# EAGLE design cdf-modular-bridge-rev4 (EAGLE 7.3.0)
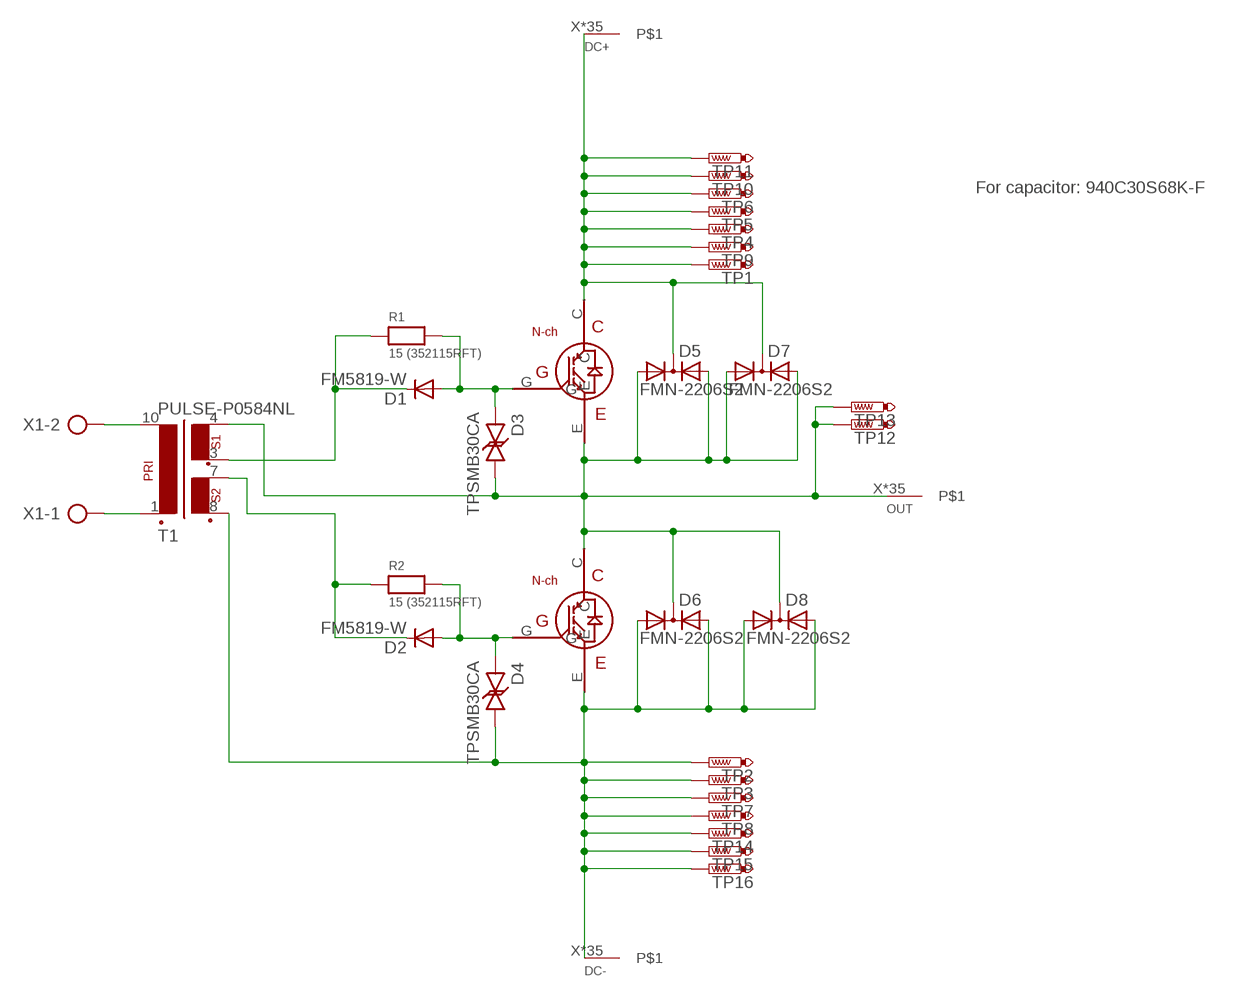
[diagram p0: schematic, sheet 1]

## Parts
D1  FM5819-W  S1A  [DO214AC]
D2  FM5819-W  S1A  [DO214AC]
D3  TPSMB30CA  TPSMB15CA  [TPSMB15CA]
D4  TPSMB30CA  TPSMB15CA  [TPSMB15CA]
D5  FMN-2206S2  [TO220-CDF-SPACED-LEGS]
D6  FMN-2206S2  [TO220-CDF-SPACED-LEGS]
D7  FMN-2206S2  [TO220-CDF-SPACED-LEGS]
D8  FMN-2206S2  [TO220-CDF-SPACED-LEGS]
DC+  BIG-ASS-HOLE  [BIG-ASS-HOLE]
DC-  BIG-ASS-HOLE  [BIG-ASS-HOLE]
OUT  BIG-ASS-HOLE  [BIG-ASS-HOLE]
Q1  Ixgh48n60a3  IXGH40N60A  [IXGH40N60A]
Q2  Ixgh48n60a3  IXGH40N60A  [IXGH40N60A]
R1  15 (352115RFT)  RESISTOR2512  [2512]
R2  15 (352115RFT)  RESISTOR2512  [2512]
T1  PULSE-P0584NL  [PULSE-P0584NL]
TP1  PTR1PAD1-17  [P1-17]
TP2  PTR1PAD1-17  [P1-17]
TP3  PTR1PAD1-17  [P1-17]
TP4  PTR1PAD1-17  [P1-17]
TP5  PTR1PAD1-17  [P1-17]
TP6  PTR1PAD1-17  [P1-17]
TP7  PTR1PAD1-17  [P1-17]
TP8  PTR1PAD1-17  [P1-17]
TP9  PTR1PAD1-17  [P1-17]
TP10  PTR1PAD1-17  [P1-17]
TP11  PTR1PAD1-17  [P1-17]
TP12  PTR1PAD1-17  [P1-17]
TP13  PTR1PAD1-17  [P1-17]
TP14  PTR1PAD1-17  [P1-17]
TP15  PTR1PAD1-17  [P1-17]
TP16  PTR1PAD1-17  [P1-17]
X1  AK500/2  [AK500/2]

## Nets
DC+: D5.C D7.C DC+.X DC+.X@1 DC+.X@2 DC+.X@3 DC+.X@4 DC+.X@5 DC+.X@6 DC+.X@7 DC+.X@8 DC+.X@9 DC+.X@10 DC+.X@11 DC+.X@12 DC+.X@13 DC+.X@14 DC+.X@15 DC+.X@16 DC+.X@17 DC+.X@18 DC+.X@19 DC+.X@20 DC+.X@21 DC+.X@22 DC+.X@23 DC+.X@24 DC+.X@25 DC+.X@26 DC+.X@27 DC+.X@28 DC+.X@29 DC+.X@30 DC+.X@31 DC+.X@32 DC+.X@34 DC+.X@120 Q1.C TP1.TP TP4.TP TP5.TP TP6.TP TP9.TP TP10.TP TP11.TP
DC-: D4.P$2 D6.A1 D6.A2 D8.A1 D8.A2 DC-.X DC-.X@1 DC-.X@2 DC-.X@3 DC-.X@4 DC-.X@5 DC-.X@6 DC-.X@7 DC-.X@8 DC-.X@9 DC-.X@10 DC-.X@11 DC-.X@12 DC-.X@13 DC-.X@14 DC-.X@15 DC-.X@16 DC-.X@17 DC-.X@18 DC-.X@19 DC-.X@20 DC-.X@21 DC-.X@22 DC-.X@23 DC-.X@24 DC-.X@25 DC-.X@26 DC-.X@27 DC-.X@28 DC-.X@29 DC-.X@30 DC-.X@31 DC-.X@32 DC-.X@34 DC-.X@120 Q2.E T1.8(SEC2_POS) TP2.TP TP3.TP TP7.TP TP8.TP TP14.TP TP15.TP TP16.TP
N$1: T1.10(PRI_NEG) X1.2
N$2: T1.1(PRI_POS) X1.1
N$3: D1.A D3.P$1 Q1.G R1.2
N$5: D2.A D4.P$1 Q2.G R2.2
N$7: D2.C R2.1 T1.7(SEC2_NEG)
N$8: D1.C R1.1 T1.3(SEC1_POS)
OUT: D3.P$2 D5.A1 D5.A2 D6.C D7.A1 D7.A2 D8.C OUT.X OUT.X@1 OUT.X@2 OUT.X@3 OUT.X@4 OUT.X@5 OUT.X@6 OUT.X@7 OUT.X@8 OUT.X@9 OUT.X@10 OUT.X@11 OUT.X@12 OUT.X@13 OUT.X@14 OUT.X@15 OUT.X@16 OUT.X@17 OUT.X@18 OUT.X@19 OUT.X@20 OUT.X@21 OUT.X@22 OUT.X@23 OUT.X@24 OUT.X@25 OUT.X@26 OUT.X@27 OUT.X@28 OUT.X@29 OUT.X@30 OUT.X@31 OUT.X@32 OUT.X@34 OUT.X@120 Q1.E Q2.C T1.4(SEC1_NEG) TP12.TP TP13.TP

## Notes on the sheet
- For capacitor: 940C30S68K-F

## Library data of the parts
D1 D2 = s1x_10:S1*: S1A - S1M General Purpose Rectifiers Source: http://www.fairchildsemi.com/datasheets/S1/S1A.pdf; MF: Fairchild; MPN: S1A; OC_FARNELL: 9843868; OC_NEWARK: 58K9551
D3 D4 = keves:TPSMB15CA
D5-D8 = keves:FMN-2206S
DC+ DC- OUT = keves:BIG-ASS-HOLE
Q1 Q2 = keves:IXGH40N60A
R1 R2 = microbuilder:RESISTOR: Resistors 0402 - 0402 Surface Mount Package 22 Ohm 1% 1/16W [Digikey: 311-22.0LRTR-ND] 33 Ohm 5% 1/16W 1.0K 5% 1/16W 1.5K 5% 1/16W 2.0K 1% 1/16W 10.0K 1% 1/16W [Digikey: 311-10.0KLRTR-ND] 10.0K 5% 1/16W [Digikey: RMCF0402JT10K0TR-ND] 12.1K 1% 1/16W [Digikey: 311-22.0LRTR-ND] 100.0K 5% 1/16W 0603 - 0603 Surface Mount Package 0 Ohm 1/10 Watt 1% Resistor 15 Ohm 1/10 Watt 1% Resistor 33 Ohm 1/10 Watt 1% Resistor 49.9 Ohm 1/10 Watt 1% Resistor 100 Ohm 1/10 Watt 1% Resistor 150 Ohm 1/10 Watt 1% Resistor 240 Ohm 1/10 Watt 1% Resistor 390 Ohm 1/10 Watt 1% Resistor 560 Ohm 1/10 Watt 1% Resistor 680 Ohm 1/10 Watt 1% Resistor 750 Ohm 1/10 Watt 1% Resistor 1.0K Ohm 1/10 Watt 1% Resistor 1.5K Ohm 1/10 Watt 1% Resistor 2.0K Ohm 1/10 Watt 1% Resistor 2.2K Ohm 1/10 Watt 1% Resistor 3.3K Ohm 1/10 Watt 1% Resistor 4.7K Ohm 1/10 Watt 1% Resistor 10.0K Ohm 1/10 Watt 1% Resistor 12.0K Ohm 1/10 Watt 1% Resistor 12.1K Ohm 1/10 Watt 1% Resistor 20.0K Ohm 1/10 Watt 1% Resistor 33.0K Ohm 1/10 Watt 1% Resistor 100.0K Ohm 1/10 Watt 1% Resistor 0805 - 0805 Surface Mount Package 0 Ohm 1/8 Watt 1% Resistor 33 Ohm 1/8 Watt 1% Resistor 100 Ohm 1/8 Watt 1% Resistor 150 Ohm 1/8 Watt 1% Resistor 200 Ohm 1/8 Watt 1% Resistor 240 Ohm 1/8 Watt 1% Resistor 330 Ohm 1/8 Watt 1% Resistor 390 Ohm 1/8 Watt 1% Resistor 470 Ohm 1/8 Watt 1% Resistor 1.0K Ohm 1/8 Watt 1% Resistor 1.5K Ohm 1/8 Watt 1% Resistor 2.0K Ohm 1/8 Watt 1% Resistor 4.7K Ohm 1/8 Watt 1% Resistor 5.1K Ohm 1/8 Watt 1% Resistor 5.6K Ohm 1/8 Watt 1% Resistor 10.0K Ohm 1/8 Watt 1% Resistor 22.0K Ohm 1/8 Watt 1% Resistor 33.0K Ohm 1/8 Watt 1% Resistor 100K Ohm 1/8 Watt 1% Resistor 1206 - 1206 Surface Mount Package 2012 - 2010 Surface Mount Package 0.11 Ohm 1/2 Watt 1% Resistor - Digikey: RHM.11UCT-ND
T1 = keves:PULSE-P0584NL
TP1-TP16 = testpad:PTR1: TEST PIN
X1 = con-ptr500:AK500/2: CONNECTOR; OC_FARNELL: unknown; OC_NEWARK: unknown

## Board
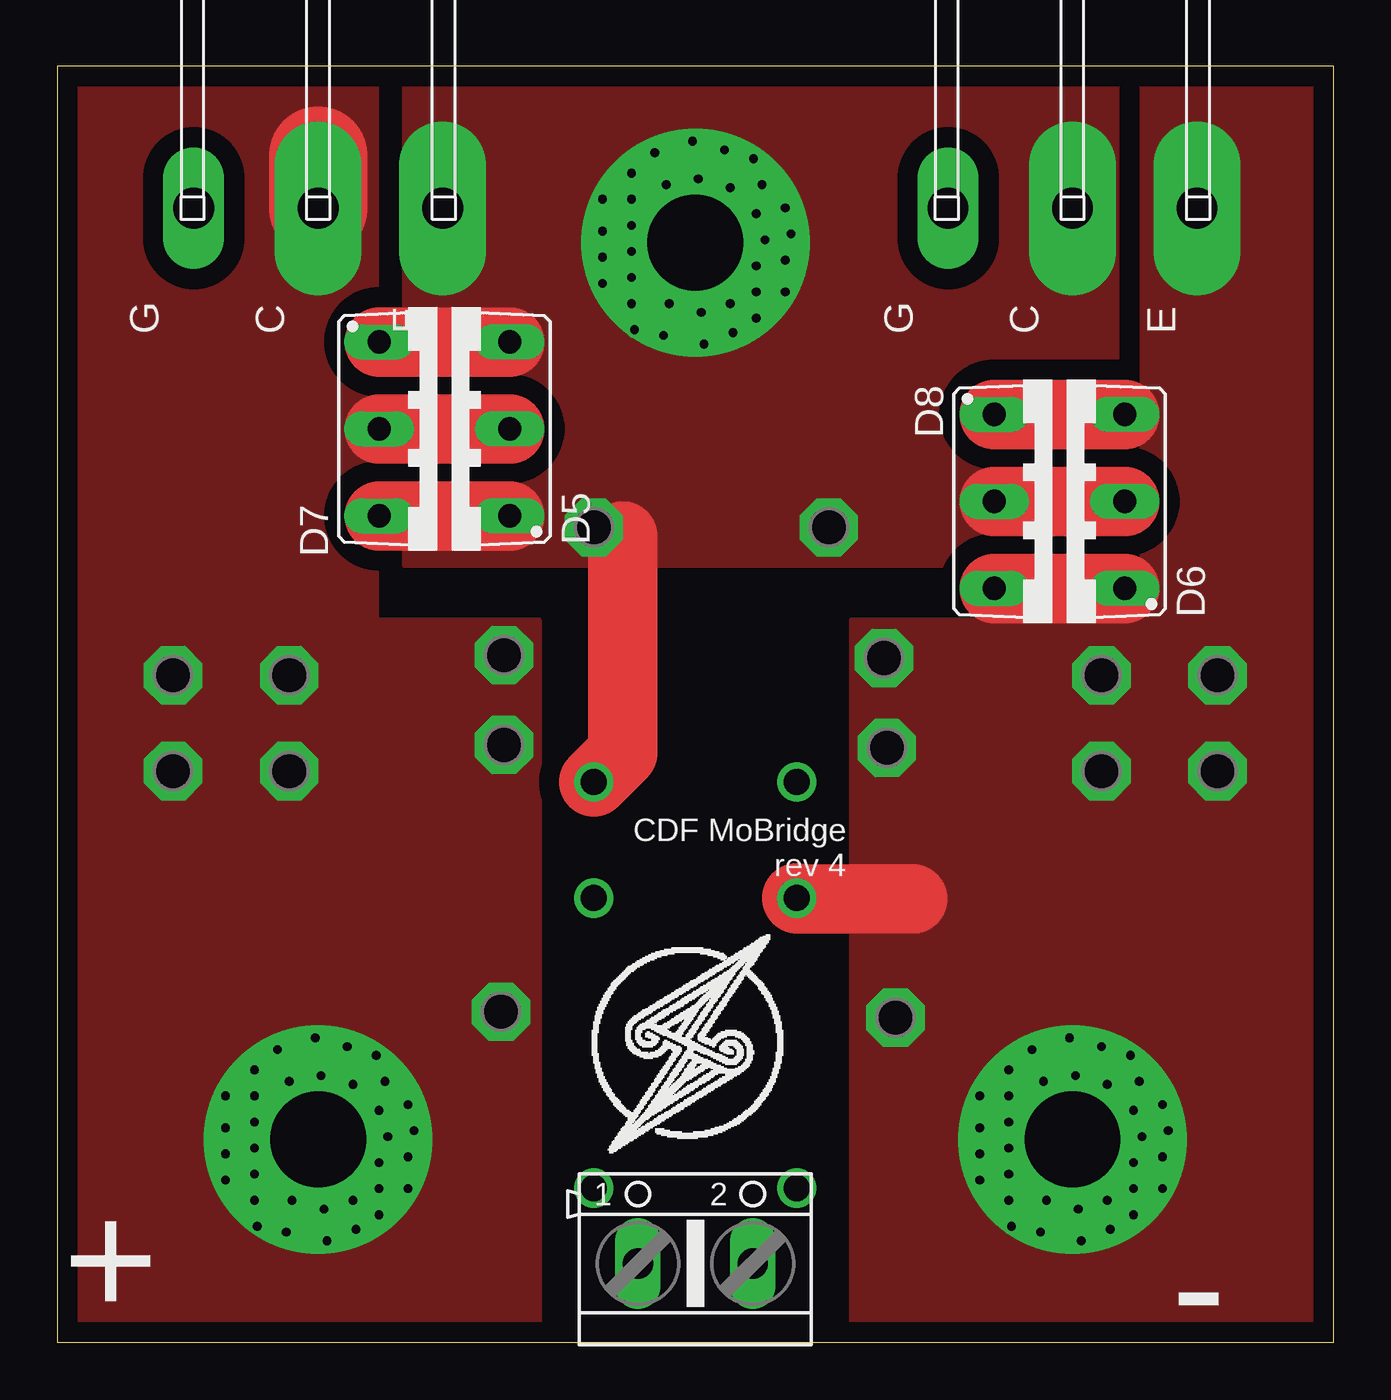
[diagram p1: board, top side]
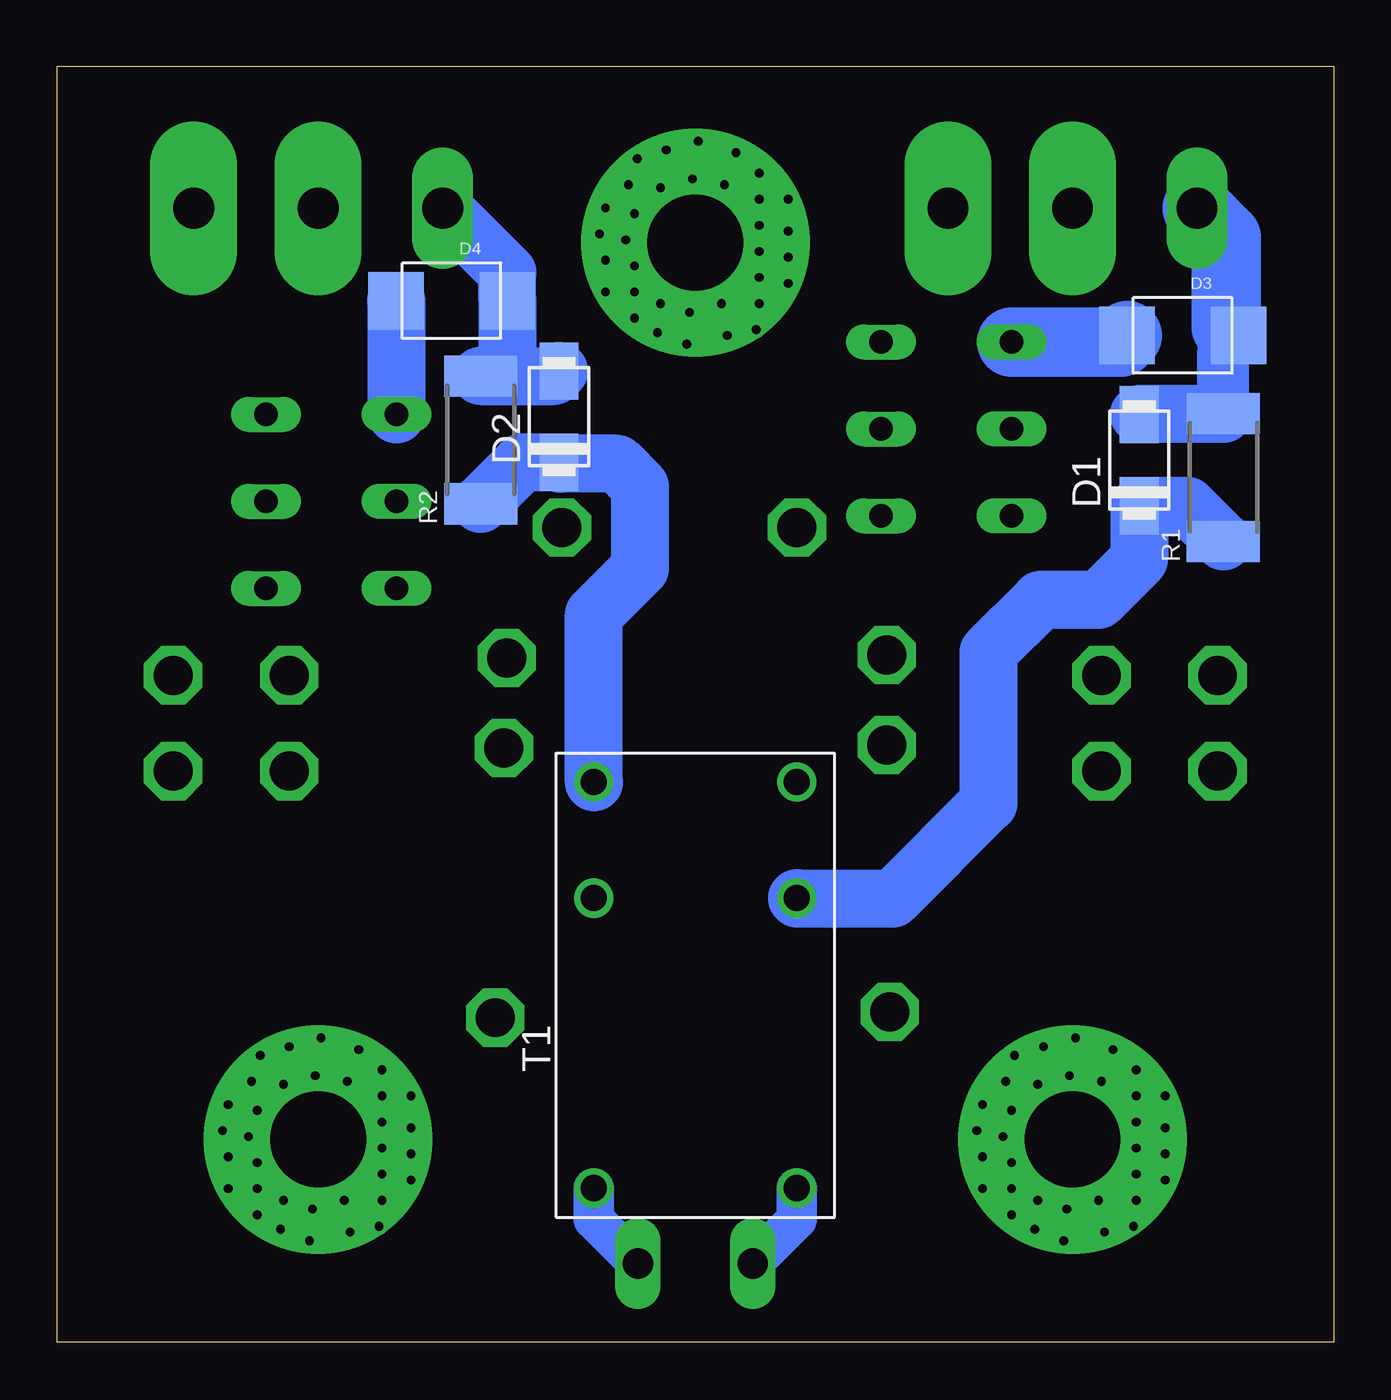
[diagram p2: board, bottom side, seen from below]

Size 55.88 x 55.88 mm. Coordinates in mm from the lower left corner, seen from the top.
Outline: 0,0 55.88,0 55.88,55.88 0,55.88 0,0
Copper layers (1*16): Top 0.0356mm / dielectric 1.5011mm / Bottom 0.0356mm
Design rules "oshpark *": minimum track width 6mil, minimum drill 13mil, track to track 6mil, track to pad 6mil, pad to pad 6mil, via to via 6mil, smd to smd 6mil, copper to edge 15mil, drill to drill 6mil, minimum pad ring 7mil, minimum via ring 7mil, stop-mask expansion 3mil, vias tented up to drill 0mil, thermal gap 10mil

### Footprints (pad centres in the part's own frame; a part is rotated, then mirrored left to right if it is on the bottom)
DO214AC = smd 2.5 x 1.7: A 2,0; C -2,0
TPSMB15CA = smd 2.413 x 2.515: P$1 -2.438,0; P$2 2.438,0
TO220-CDF-SPACED-LEGS = drill 1.016 long: A1 -3.81,-2.54; A2 3.81,-2.54; C 0,-2.54
BIG-ASS-HOLE = drill 4.2 pad 10: X 0,0 | drill 0.381: X@1 -2.794,-2.667; X@2 -2.794,-1.524; X@3 -2.794,-0.381; X@4 -2.794,0.762; X@5 -2.794,1.905; X@6 -2.794,3.048; X@7 2.54,3.683; X@8 2.921,2.54; X@9 -4.064,-1.778; X@10 -4.064,-0.635; X@11 -4.064,0.508; X@12 -4.064,1.905; X@13 2.667,1.27; X@14 3.048,0.127; X@15 2.667,-1.016; X@16 2.667,-2.159; X@17 2.667,-3.302; X@18 3.937,1.524; X@19 4.191,0.381; X@20 3.937,-0.762; X@21 3.937,-2.159; X@22 1.524,2.413; X@23 0.127,2.794; X@24 -1.27,2.54; X@25 -1.778,3.937; X@26 -0.127,4.445; X@27 1.27,4.064; X@28 1.524,-2.667; X@29 1.651,-3.937; X@30 0.254,-3.048; X@31 -1.143,-2.667; X@32 -1.397,-4.064; X@34 0.381,-4.445; X@120 -2.667,-3.81
IXGH40N60A = drill 1.778 pad 3.81 long: C -44.21,0; E -44.21,-5.45 | drill 1.778 pad 2.54 long: G -44.21,5.45
2512 = smd 1.8 x 3.2: 1 -2.8,0; 2 2.8,0
PULSE-P0584NL = drill 1.143: 1 -12.7,-4.445; 3 0,-4.445; 4 5.08,-4.445; 7 5.08,4.445; 8 0,4.445; 10 -12.7,4.445
P1-17 = drill 1.702 pad 2.54 octagon: TP 0,0
AK500/2 = drill 1.321 long: 1 -2.515,0; 2 2.515,0

### Placement (x,y rotation side)
D1  8.51,38.63 90 bottom
D2  33.91,40.54 90 bottom
D3  6.6,44.09 180 bottom
D4  38.61,45.62 180 bottom
D5  17.27,40.01 90 top
D6  44.2,36.83 90 top
D7  16.64,40.01 270 top
D8  43.56,36.83 270 top
DC+  11.43,8.89 0 top
DC-  44.45,8.89 0 top
OUT  27.94,48.16 0 top
Q1  11.43,93.88 90 top
Q2  44.45,93.88 90 top
R1  4.83,37.87 90 bottom
R2  37.34,39.52 90 bottom
T1  27.94,19.46 90 bottom
TP1  5.08,25.02 0 top
TP2  50.8,25.02 0 top
TP3  45.72,25.02 0 top
TP4  10.16,25.02 0 top
TP5  5.08,29.21 0 top
TP6  10.16,29.21 0 top
TP7  45.72,29.21 0 top
TP8  50.8,29.21 0 top
TP9  19.56,26.16 0 top
TP10  19.56,30.1 0 top
TP11  19.43,14.48 0 top
TP12  33.78,35.69 0 top
TP13  23.5,35.69 0 top
TP14  36.32,26.04 0 top
TP15  36.7,14.22 0 top
TP16  36.2,29.97 0 top
X1  27.94,3.45 0 top

### Tracks (layer width: path | path; a pad name or v marks a point on that pad's centre or on a via)
DC+
  Top 3.048: D7.C D5.C
  Top 4.318: 11.43,51.97 Q1.C
  pour Top (isolate 0.889, no thermals): 0.13,31.62 21.08,31.62 21.08,0.13 0.13,0.13
  pour Top (isolate 0.889, no thermals): 13.97,29.21 13.97,56.39 0.13,56.39 0.13,29.21
DC-
  Top 3.048: D6.A2 D8.A1 | D8.A2 D6.A1 | T1.8 32.41,19.43 37.47,19.43
  Bottom 2.54: D8.A1 41.02,45.59 D4.P$2
  pour Top (isolate 0.889, no thermals): 34.8,31.62 58.67,31.62 58.67,0.13 34.8,0.13
  pour Top (isolate 0.889, no thermals): 47.5,30.48 59.18,30.48 59.18,56.39 47.5,56.39
N$1
  Bottom 1.778: X1.2 32.38,5.38 T1.10
N$2
  Bottom 1.778: X1.1 23.5,5.38 T1.1
N$3
  Bottom 1.778: 4.7,44.45 4.34,44.09 D3.P$1
  Bottom 2.286: R1.2 4.83,43.43 D3.P$1
  Bottom 2.54: D1.A 8.47,40.67 R1.2
  Bottom 3.048: Q1.G 4.7,48.39 4.7,44.45
N$5
  Bottom 2.54: Q2.G 36.17,46.84 D4.P$1 36.17,42.42 36.07,42.32 | R2.2 36.07,42.32 | 36.07,42.32 34.12,42.32 D2.A
N$7
  Bottom 2.54: R2.1 35.52,38.54 D2.C 33.85,38.48 31.37,38.48 30.35,37.47 30.35,33.91 32.38,31.88 T1.7
N$8
  Bottom 2.54: R1.1 6.39,36.63 D1.C 8.51,34.29 10.29,32.51 12.83,32.51 15.11,30.23 15.11,23.62 19.3,19.43 23.47,19.43 T1.3
OUT
  Top 3.048: D5.A2 D7.A1 | D5.A1 D7.A2 | D6.C D8.C | T1.4 24.77,25.81 24.77,35.31
  Bottom 3.048: D3.P$2 9.32,43.81 D7.A1
  pour Top (isolate 0.889, rank 2, no thermals): 15.24,56.39 46.74,56.39 46.74,34.04 15.24,34.04

### Text on the board
tPlace: CDF MoBridge / rev 4 | + | -